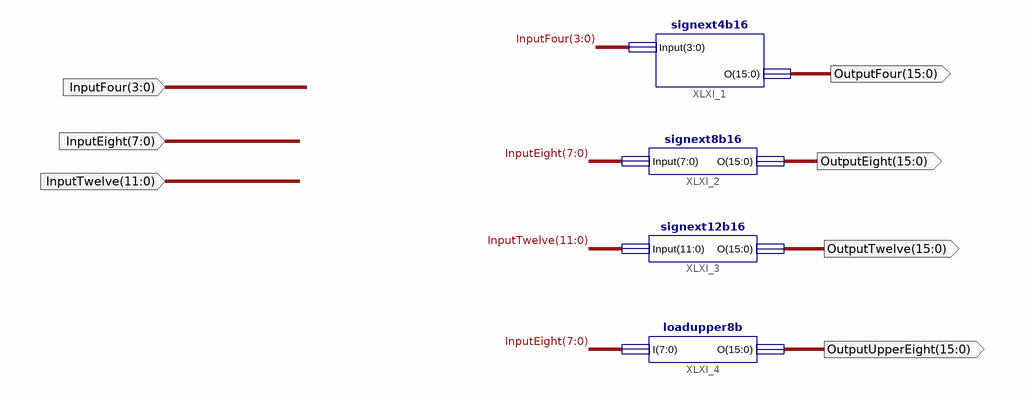
[diagram p0: schematic sheet 1]
// Xilinx ISE schematic test_signext.sch (spartan3e) as structural Verilog: 4 symbols, 7 ports
module test_signext (
  input  [3:0] InputFour,
  input  [7:0] InputEight,
  input  [11:0] InputTwelve,
  output [15:0] OutputTwelve,
  output [15:0] OutputEight,
  output [15:0] OutputFour,
  output [15:0] OutputUpperEight
);

  signext4b16 XLXI_1 (.Input(InputFour), .O(OutputFour));
  signext8b16 XLXI_2 (.Input(InputEight), .O(OutputEight));
  signext12b16 XLXI_3 (.Input(InputTwelve), .O(OutputTwelve));
  loadupper8b XLXI_4 (.I(InputEight), .O(OutputUpperEight));
endmodule
